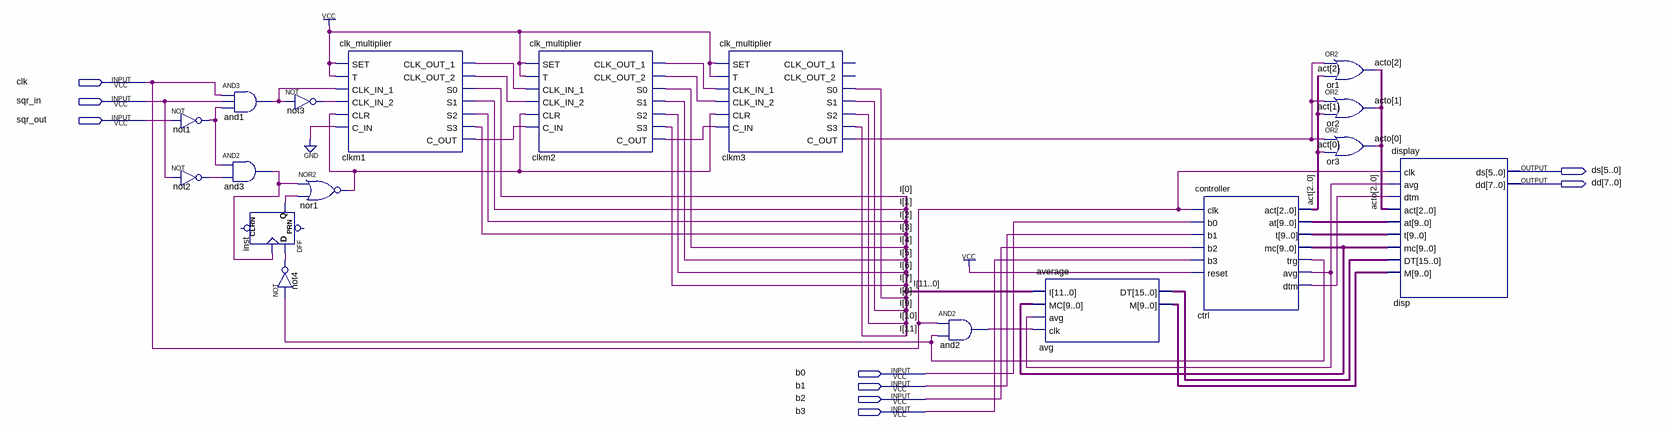
[diagram p0: schematic sheet]
// Quartus schematic nmm.bdf as structural Verilog: 18 symbols, 9 pins
module nmm (
  input  clk,
  input  sqr_in,
  input  sqr_out,
  input  b0,
  input  b1,
  input  b2,
  input  b3,
  output [5:0] ds,
  output [7:0] dd
);

  wire and1_out, and2_out, and3_out, clkm1_c_out, clkm1_clk_out_1, clkm1_clk_out_2, clkm2_c_out,
       clkm2_clk_out_1, clkm2_clk_out_2, clkm3_c_out, ctrl_avg, ctrl_dtm, ctrl_trg, inst_q, nor1_out,
       not1_out, not2_out, not3_out, not4_out;
  wire [2:0] act, acto;
  wire [9:0] avg_m, ctrl_at, ctrl_mc, ctrl_t;
  wire [11:0] I;
  wire [15:0] avg_dt;

  not not1 (not1_out, sqr_out);
  not not2 (not2_out, sqr_in);
  and and1 (and1_out, clk, sqr_in, not1_out);
  and and3 (and3_out, not1_out, not2_out);
  DFF inst (.CLK(and3_out), .D(not4_out), .Q(inst_q));  // open: CLRN, PRN
  not not3 (not3_out, and1_out);
  nor nor1 (nor1_out, and3_out, inst_q);
  not not4 (not4_out, ctrl_trg);
  clk_multiplier clkm1 (
    .SET(1'b1), .T(1'b1), .CLK_IN_1(and1_out), .CLK_IN_2(not3_out), .CLR(nor1_out), .C_IN(1'b0),
    .CLK_OUT_1(clkm1_clk_out_1), .CLK_OUT_2(clkm1_clk_out_2), .S3(I[3]), .C_OUT(clkm1_c_out), .S0(I[0]),
    .S1(I[1]), .S2(I[2]));
  clk_multiplier clkm2 (
    .SET(1'b1), .T(1'b1), .CLK_IN_1(clkm1_clk_out_1), .CLK_IN_2(clkm1_clk_out_2), .CLR(nor1_out),
    .C_IN(clkm1_c_out), .CLK_OUT_1(clkm2_clk_out_1), .CLK_OUT_2(clkm2_clk_out_2), .S3(I[7]),
    .C_OUT(clkm2_c_out), .S0(I[4]), .S1(I[5]), .S2(I[6]));
  clk_multiplier clkm3 (
    .SET(1'b1), .T(1'b1), .CLK_IN_1(clkm2_clk_out_1), .CLK_IN_2(clkm2_clk_out_2), .CLR(nor1_out),
    .C_IN(clkm2_c_out), .S3(I[11]), .C_OUT(clkm3_c_out), .S0(I[8]), .S1(I[9]), .S2(I[10]));  // open: CLK_OUT_1, CLK_OUT_2
  and and2 (and2_out, clk, ctrl_trg);
  average avg (.I(I), .MC(ctrl_mc), .avg(ctrl_avg), .clk(and2_out), .DT(avg_dt), .M(avg_m));
  controller ctrl (
    .clk(clk), .b0(b0), .b1(b1), .b2(b2), .b3(b3), .reset(1'b1), .act(act), .at(ctrl_at), .t(ctrl_t),
    .mc(ctrl_mc), .trg(ctrl_trg), .avg(ctrl_avg), .dtm(ctrl_dtm));
  or or1 (acto[2], clkm3_c_out, act[2]);
  or or2 (acto[1], clkm3_c_out, act[1]);
  or or3 (acto[0], clkm3_c_out, act[0]);
  display disp (
    .clk(clk), .avg(ctrl_avg), .dtm(ctrl_dtm), .act(acto), .at(ctrl_at), .t(ctrl_t), .mc(ctrl_mc),
    .DT(avg_dt), .M(avg_m), .ds(ds), .dd(dd));
endmodule
